# EAGLE design 2 (EAGLE 9.6.2)
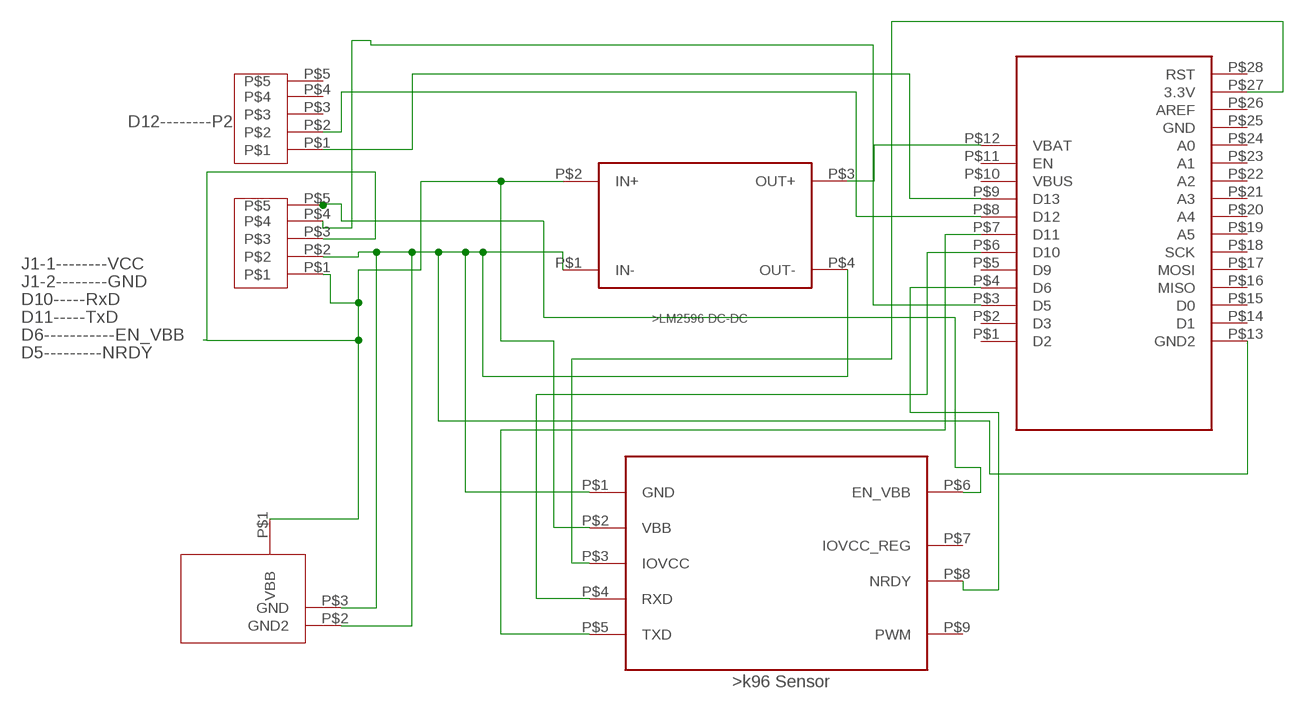
[diagram p0: schematic, sheet 1]

## Parts
DCDC1  DCDC  [DCDC]
FEATHER1  FEATHER  [FEATHER]
K96SENSOR1  K96SENSOR  [K96SENSOR]
PIN1  PIN  [PIN]
PIN2  PIN  [PIN]
U$1  POWER  [POWERIN]

## Nets
N$2: DCDC1.P$1(IN-) DCDC1.P$4(OUT-) FEATHER1.P$13(GND2) K96SENSOR1.P$1(GND) PIN1.P$2 U$1.P$2(GND2) U$1.P$3(GND)
N$3: FEATHER1.P$6(D10) K96SENSOR1.P$4(RXD)
N$4: DCDC1.P$3(OUT+) FEATHER1.P$12(VBAT)
N$5: FEATHER1.P$7(D11) K96SENSOR1.P$5(TXD)
N$6: FEATHER1.P$4(D6) K96SENSOR1.P$8(NRDY)
N$7: FEATHER1.P$9(D13) PIN2.P$1
N$8: K96SENSOR1.P$6(EN_VBB) PIN1.P$5
N$9: FEATHER1.P$27(3.3V) K96SENSOR1.P$3(IOVCC)
N$10: FEATHER1.P$8(D12) PIN2.P$2
N$11: FEATHER1.P$3(D5) PIN1.P$4
N$12: DCDC1.P$2(IN+) K96SENSOR1.P$2(VBB) PIN1.P$1 PIN1.P$3 U$1.P$1(VBB)
Unconnected: FEATHER1.P$1(D2) FEATHER1.P$2(D3) FEATHER1.P$5(D9) FEATHER1.P$10(VBUS) FEATHER1.P$11(EN) FEATHER1.P$14(D1) FEATHER1.P$15(D0) FEATHER1.P$16(MISO) FEATHER1.P$17(MOSI) FEATHER1.P$18(SCK) FEATHER1.P$19(A5) FEATHER1.P$20(A4) FEATHER1.P$21(A3) FEATHER1.P$22(A2) FEATHER1.P$23(A1) FEATHER1.P$24(A0) FEATHER1.P$25(GND) FEATHER1.P$26(AREF) FEATHER1.P$28(RST) K96SENSOR1.P$7(IOVCC_REG) K96SENSOR1.P$9(PWM) PIN2.P$3 PIN2.P$4 PIN2.P$5

## Notes on the sheet
- D12--------P2
- J1-1--------VCC
- J1-2--------GND
- D10-----RxD
- D11-----TxD
- D6-----------EN_VBB
- D5---------NRDY

## Library data of the parts
DCDC1 = untitled:DCDC
FEATHER1 = untitled:FEATHER
K96SENSOR1 = untitled:K96SENSOR
PIN1 PIN2 = untitled:PIN
U$1 = untitled:POWER

## Board
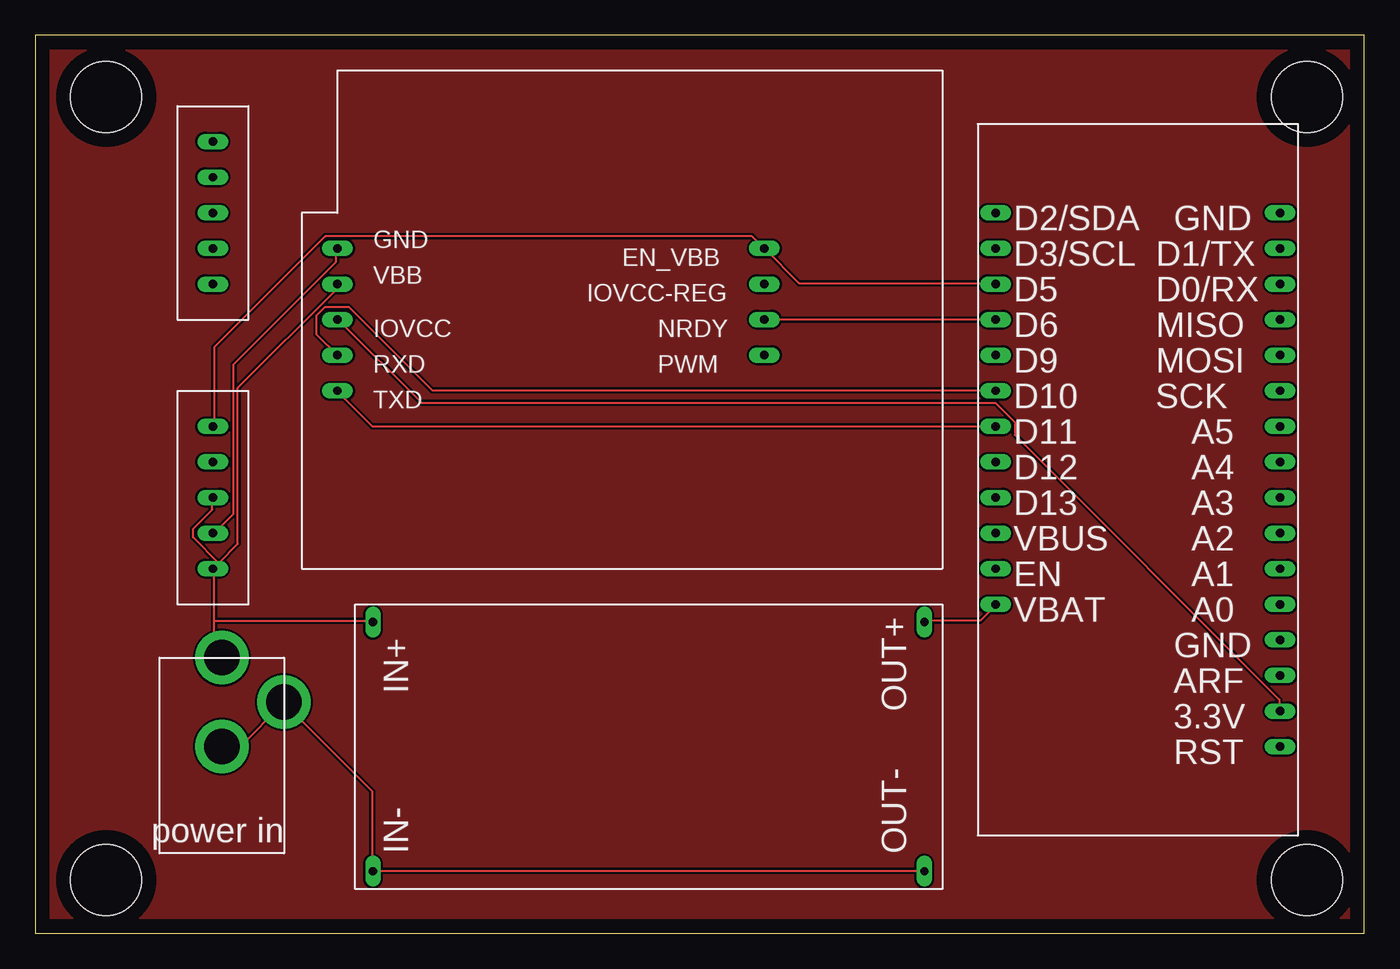
[diagram p1: board, top side]
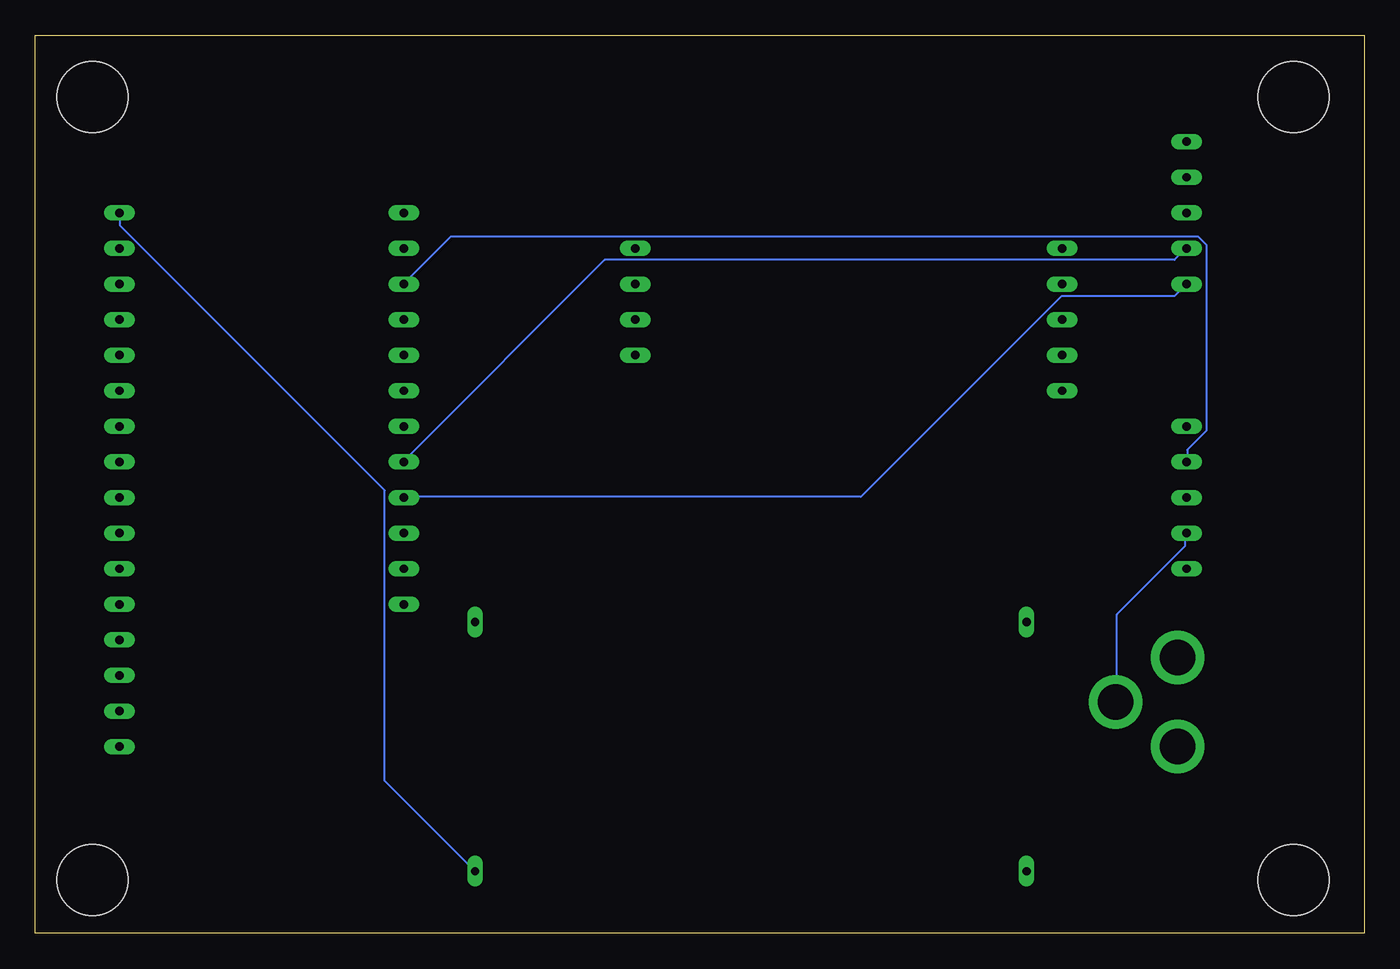
[diagram p2: board, bottom side, seen from below]

Size 94.92 x 64.12 mm. Coordinates in mm from the lower left corner, seen from the top.
Outline: 0,0 94.92,0 94.92,64.12 0,64.12 0,0
Copper layers (1*16): Top 0.035mm / dielectric 1.5mm / Bottom 0.035mm
Design rules "default": minimum track width 6mil, minimum drill 0.35mm, track to track 6mil, track to pad 6mil, pad to pad 6mil, via to via 6mil, smd to smd 6mil, copper to edge 40mil, drill to drill 6mil, minimum pad ring 10mil, minimum via ring 8mil, stop-mask expansion 4mil, vias tented up to drill 0mil, thermal gap 10mil
Holes 5.08 mm at 90.8,3.81 5.08,3.81 5.08,59.69 90.8,59.69

### Footprints (pad centres in the part's own frame; a part is rotated, then mirrored left to right if it is on the bottom)
DCDC = drill 0.6 long: P$1 -17.78,0; P$2 0,0; P$3 0,-39.37; P$4 -17.78,-39.37
FEATHER = drill 0.6 long: P$1 0,-5.08; P$2 0,-7.62; P$3 0,-10.16; P$4 0,-12.7; P$5 0,-15.24; P$6 0,-17.78; P$7 0,-20.32; P$8 0,-22.86; P$9 0,-25.4; P$10 0,-27.94; P$11 0,-30.48; P$12 0,-33.02; P$13 20.32,-5.08; P$14 20.32,-7.62; P$15 20.32,-10.16; P$16 20.32,-12.7; P$17 20.32,-15.24; P$18 20.32,-17.78; P$19 20.32,-20.32; P$20 20.32,-22.86; P$21 20.32,-25.4; P$22 20.32,-27.94; P$23 20.32,-30.48; P$24 20.32,-33.02; P$25 20.32,-35.56; P$26 20.32,-38.1; P$27 20.32,-40.64; P$28 20.32,-43.18
K96SENSOR = drill 0.6 long: P$1 -17.78,-5.08; P$2 -17.78,-7.62; P$3 -17.78,-10.16; P$4 -17.78,-12.7; P$5 -17.78,-15.24; P$6 12.7,-5.08; P$7 12.7,-7.62; P$8 12.7,-10.16; P$9 12.7,-12.7
PIN = drill 0.6 long: P$1 0,-7.62; P$2 0,-5.08; P$3 0,-2.54; P$4 0,0; P$5 0,2.54
POWERIN = drill 2.54 pad 3.81: P$1 4.445,-13.97; P$2 4.445,-7.62; P$3 0,-10.795

### Placement (x,y rotation side)
DCDC1  24.13,22.23 90 top
FEATHER1  68.58,56.52 0 top
K96SENSOR1  39.37,53.98 0 top
PIN1  12.7,33.66 0 top
PIN2  12.7,53.98 0 top
U$1  17.78,5.71 180 top

### Tracks (layer width: path | path; a pad name or v marks a point on that pad's centre or on a via)
GND
  pour Top: 0,64.13 95.25,64.13 95.25,-0.63 0,-0.63
N$2
  Top 0.152: DCDC1.P$4 63.4,4.5 24.23,4.5 DCDC1.P$1 24.08,4.5 24.08,10.13 17.83,16.38 U$1.P$3 17.68,16.38 14.63,13.33 U$1.P$2 | K96SENSOR1.P$1 21.49,48.84 21.49,47.93 14.17,40.62 14.17,29.95 12.8,28.58 PIN1.P$2
  Bottom 0.152: PIN1.P$2 12.8,28.58 12.8,27.66 17.68,22.78 17.68,16.53 U$1.P$3 | DCDC1.P$4 69.95,10.9 69.95,31.62 88.85,50.52 88.85,51.44 FEATHER1.P$13
N$3
  Top 0.152: K96SENSOR1.P$4 20.12,42.75 20.12,44.12 20.73,44.73 22.4,44.73 28.35,38.79 68.58,38.79 FEATHER1.P$6
N$4
  Top 0.152: DCDC1.P$3 63.55,22.33 67.51,22.33 68.58,23.39 FEATHER1.P$12
N$5
  Top 0.152: FEATHER1.P$7 24.08,36.2 21.64,38.63 K96SENSOR1.P$5
N$6
  Top 0.152: FEATHER1.P$4 K96SENSOR1.P$8
N$7
  Bottom 0.152: PIN2.P$1 13.56,45.49 21.64,45.49 35.97,31.17 68.58,31.17 FEATHER1.P$9
N$8
  Top 0.152: 68.58,46.41 54.56,46.41 K96SENSOR1.P$6 51.21,49.76 20.73,49.76 12.8,41.83 12.8,36.2 PIN1.P$5
N$9
  Top 0.152: FEATHER1.P$27 88.85,15.93 88.85,16.69 69.95,35.59 69.95,36.5 68.58,37.87 27.58,37.87 21.64,43.82 K96SENSOR1.P$3
N$10
  Bottom 0.152: FEATHER1.P$8 68.58,33.76 54.25,48.08 13.56,48.08 12.8,48.84 PIN2.P$2
N$11
  Bottom 0.152: PIN1.P$4 12.65,33.76 12.65,34.52 11.28,35.89 11.28,49.15 11.89,49.76 65.23,49.76 68.58,46.41 FEATHER1.P$3
N$12
  Top 0.152: 12.8,22.33 12.8,20.19 13.26,19.74 U$1.P$1 | 12.8,22.33 12.8,25.98 PIN1.P$1 | 12.8,22.33 24.08,22.33 DCDC1.P$2 | K96SENSOR1.P$2 21.49,46.25 21.49,45.95 14.48,38.94 14.48,27.81 13.11,26.44 | 13.11,26.44 PIN1.P$1 | 13.11,26.44 11.28,28.27 11.28,28.88 12.65,30.25 12.65,31.01 PIN1.P$3 | 12.8,26.14 PIN1.P$1

### Text on the board
tValues: D12 | D13